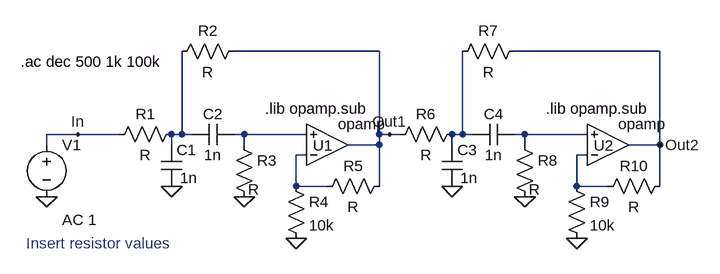
[diagram p0: schematic Exerc4_2template.asc]
Exerc4_2template.asc, the LTspice schematic file:
Version 4
SHEET 1 944 680
WIRE 464 80 240 80
WIRE 896 80 672 80
WIRE 0 208 -48 208
WIRE 64 208 0 208
WIRE 160 208 160 80
WIRE 160 208 144 208
WIRE 176 208 160 208
WIRE 256 208 240 208
WIRE 352 208 256 208
WIRE 464 208 464 80
WIRE 480 208 464 208
WIRE 496 208 480 208
WIRE 592 208 592 80
WIRE 592 208 576 208
WIRE 608 208 592 208
WIRE 688 208 672 208
WIRE 784 208 688 208
WIRE -48 224 -48 208
WIRE 144 224 144 208
WIRE 256 224 256 208
WIRE 464 224 464 208
WIRE 464 224 416 224
WIRE 576 224 576 208
WIRE 688 224 688 208
WIRE 896 224 896 80
WIRE 896 224 848 224
WIRE 352 240 336 240
WIRE 784 240 768 240
WIRE 336 288 336 240
WIRE 384 288 336 288
WIRE 464 288 464 224
WIRE 768 288 768 240
WIRE 816 288 768 288
WIRE 896 288 896 224
FLAG 336 368 0
FLAG 256 304 0
FLAG 144 288 0
FLAG -48 304 0
FLAG 768 368 0
FLAG 688 304 0
FLAG 576 288 0
FLAG 0 208 In
FLAG 480 208 Out1
FLAG 896 224 Out2
SYMBOL voltage -48 208 R0
WINDOW 123 24 132 Left 0
WINDOW 39 0 0 Left 0
SYMATTR Value2 AC 1
SYMATTR InstName V1
SYMATTR Value ""
SYMBOL res 48 224 R270
WINDOW 0 32 56 VTop 0
WINDOW 3 0 56 VBottom 0
SYMATTR InstName R1
SYMBOL res 144 96 R270
WINDOW 0 32 56 VTop 0
WINDOW 3 0 56 VBottom 0
SYMATTR InstName R2
SYMBOL res 240 208 R0
WINDOW 3 22 85 Left 0
SYMATTR InstName R3
SYMBOL cap 128 224 R0
WINDOW 3 29 51 Left 0
SYMATTR Value 1n
SYMATTR InstName C1
SYMBOL cap 176 224 R270
WINDOW 0 32 32 VTop 0
WINDOW 3 0 32 VBottom 0
SYMATTR InstName C2
SYMATTR Value 1n
SYMBOL Opamps\\opamp 384 288 M180
WINDOW 0 -22 63 Left 0
SYMATTR InstName U1
SYMBOL res 320 272 R0
SYMATTR InstName R4
SYMATTR Value 10k
SYMBOL res 480 272 R90
WINDOW 0 0 56 VBottom 0
WINDOW 3 32 56 VTop 0
SYMATTR InstName R5
SYMBOL res 480 224 R270
WINDOW 0 32 56 VTop 0
WINDOW 3 0 56 VBottom 0
SYMATTR InstName R6
SYMBOL res 576 96 R270
WINDOW 0 32 56 VTop 0
WINDOW 3 0 56 VBottom 0
SYMATTR InstName R7
SYMBOL res 672 208 R0
WINDOW 3 22 85 Left 0
SYMATTR InstName R8
SYMBOL cap 560 224 R0
WINDOW 3 29 51 Left 0
SYMATTR Value 1n
SYMATTR InstName C3
SYMBOL cap 608 224 R270
WINDOW 0 32 32 VTop 0
WINDOW 3 0 32 VBottom 0
SYMATTR InstName C4
SYMATTR Value 1n
SYMBOL Opamps\\opamp 816 288 M180
WINDOW 0 -22 63 Left 0
SYMATTR InstName U2
SYMBOL res 752 272 R0
SYMATTR InstName R9
SYMATTR Value 10k
SYMBOL res 912 272 R90
WINDOW 0 0 56 VBottom 0
WINDOW 3 32 56 VTop 0
SYMATTR InstName R10
TEXT 288 168 Left 0 !.lib opamp.sub
TEXT 720 168 Left 0 !.lib opamp.sub
TEXT -88 96 Left 0 !.ac dec 500 1k 100k
TEXT -80 376 Left 0 ;Insert resistor values

The netlist it stands for:
* Exerc4_2template.asc
V1 In 0 AC 1
R1 In N001 R
R2 N001 Out1 R
R3 N002 0 R
C1 N001 0 1n
C2 N001 N002 1n
XU1 N005 N002 Out1 opamp Aol=100K GBW=10Meg  ; pins invin noninvin out
R4 N005 0 10k
R5 Out1 N005 R
R6 Out1 N003 R
R7 N003 Out2 R
R8 N004 0 R
C3 N003 0 1n
C4 N003 N004 1n
XU2 N006 N004 Out2 opamp Aol=100K GBW=10Meg  ; pins invin noninvin out
R9 N006 0 10k
R10 Out2 N006 R
.lib opamp.sub
.lib opamp.sub
.ac dec 500 1k 100k
* Insert resistor values
.backanno
.end